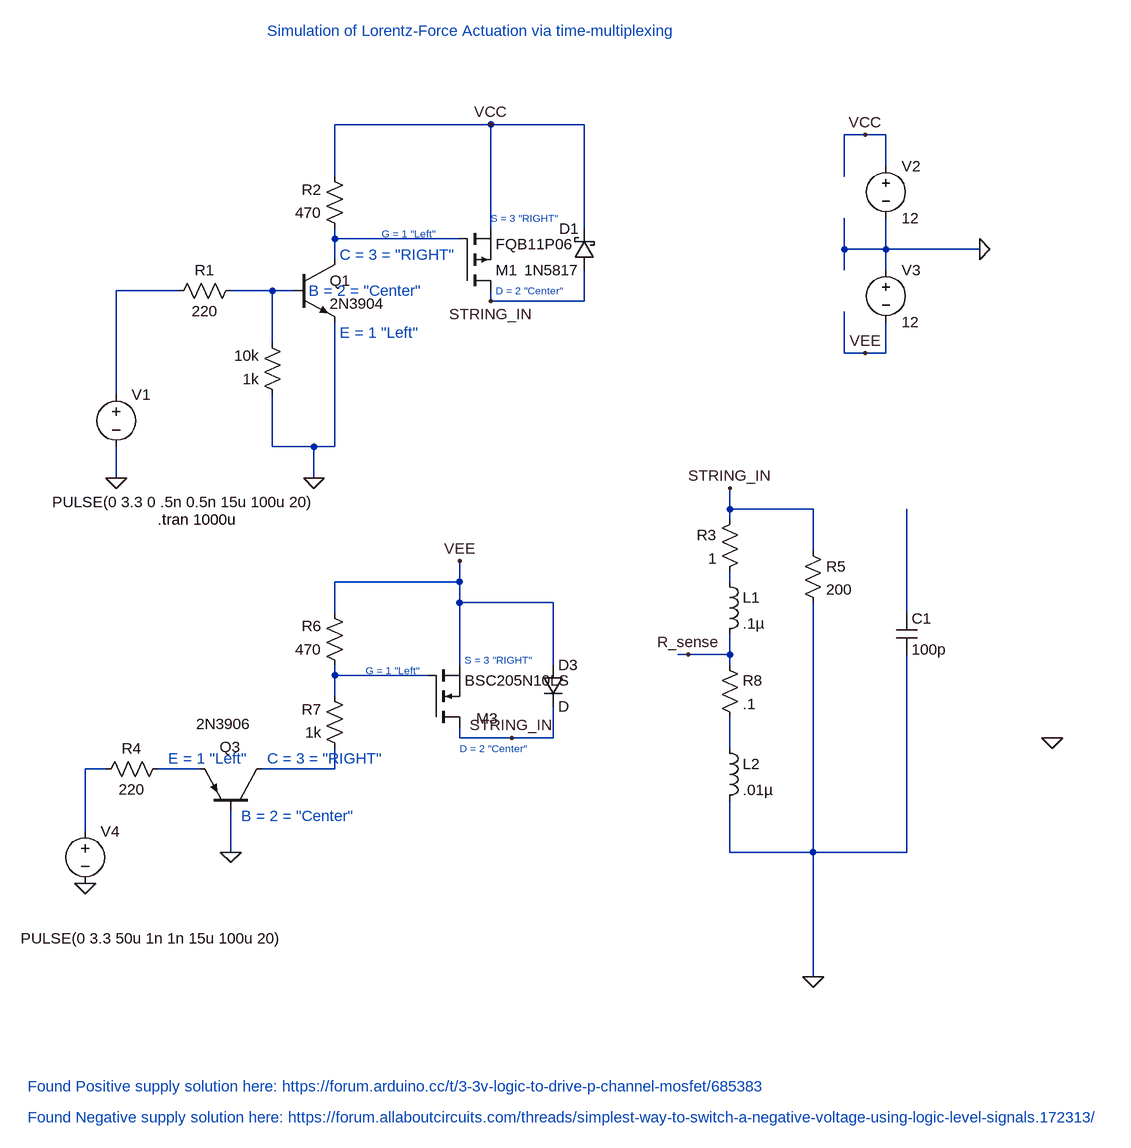
[diagram p0: schematic LF-TIME-MULTIPLEX-ACTUATION.asc]
LF-TIME-MULTIPLEX-ACTUATION.asc, the LTspice schematic file:
Version 4
SHEET 1 1528 1824
WIRE 544 -176 304 -176
WIRE 688 -176 544 -176
WIRE 1120 -160 1088 -160
WIRE 1152 -160 1120 -160
WIRE 1152 -112 1152 -160
WIRE 304 -96 304 -176
WIRE 1088 -96 1088 -160
WIRE 544 -16 544 -176
WIRE 688 -16 688 -176
WIRE 304 0 304 -16
WIRE 496 0 304 0
WIRE 1088 16 1088 -32
WIRE 1152 16 1152 -32
WIRE 1152 16 1088 16
WIRE 1296 16 1152 16
WIRE 304 32 304 0
WIRE 1088 48 1088 16
WIRE 1152 48 1152 16
WIRE 64 80 -32 80
WIRE 208 80 144 80
WIRE 240 80 208 80
WIRE 544 96 544 80
WIRE 688 96 688 48
WIRE 688 96 544 96
WIRE 208 160 208 80
WIRE 1088 176 1088 112
WIRE 1120 176 1088 176
WIRE 1152 176 1152 128
WIRE 1152 176 1120 176
WIRE -32 240 -32 80
WIRE 208 320 208 240
WIRE 272 320 208 320
WIRE 304 320 304 128
WIRE 304 320 272 320
WIRE -32 368 -32 320
WIRE 272 368 272 320
WIRE 912 416 912 384
WIRE 1040 416 912 416
WIRE 912 432 912 416
WIRE 1040 480 1040 416
WIRE 496 528 496 496
WIRE 496 528 304 528
WIRE 912 528 912 512
WIRE 496 560 496 528
WIRE 640 560 496 560
WIRE 304 576 304 528
WIRE 1184 576 1184 416
WIRE 848 640 832 640
WIRE 912 640 912 608
WIRE 912 640 848 640
WIRE 496 656 496 560
WIRE 640 656 640 560
WIRE 912 656 912 640
WIRE 304 672 304 656
WIRE 448 672 304 672
WIRE 304 704 304 672
WIRE 496 768 496 752
WIRE 576 768 496 768
WIRE 640 768 640 720
WIRE 640 768 576 768
WIRE 912 784 912 736
WIRE -48 816 -80 816
WIRE 96 816 32 816
WIRE 304 816 304 784
WIRE 304 816 192 816
WIRE -80 912 -80 816
WIRE 144 944 144 880
WIRE 912 944 912 864
WIRE 1040 944 1040 560
WIRE 1040 944 912 944
WIRE 1184 944 1184 640
WIRE 1184 944 1040 944
WIRE 1040 1136 1040 944
FLAG -32 368 0
FLAG 1120 176 VEE
FLAG 1296 16 0
FLAG 1120 -160 VCC
FLAG 272 368 0
FLAG 544 -176 VCC
FLAG 1040 1136 0
FLAG 912 384 STRING_IN
FLAG 544 96 STRING_IN
FLAG -80 992 0
FLAG 496 496 VEE
FLAG 576 768 STRING_IN
FLAG 144 944 0
FLAG 1408 768 0
FLAG 848 640 R_sense
SYMBOL voltage -32 224 R0
WINDOW 3 -99 181 Left 2
SYMATTR Value PULSE(0 3.3 0 .5n 0.5n 15u 100u 20)
SYMATTR InstName V1
SYMBOL voltage 1152 -128 R0
SYMATTR InstName V2
SYMATTR Value 12
SYMBOL pmos 496 80 M180
SYMATTR InstName M1
SYMATTR Value FQB11P06
SYMBOL npn 240 32 R0
SYMATTR InstName Q1
SYMATTR Value 2N3904
SYMBOL res 160 64 R90
WINDOW 0 0 56 VBottom 2
WINDOW 3 32 56 VTop 2
SYMATTR InstName R1
SYMATTR Value 220
SYMBOL res 320 0 R180
WINDOW 0 36 76 Left 2
WINDOW 3 36 40 Left 2
SYMATTR InstName R2
SYMATTR Value 470
SYMBOL res 928 416 M0
SYMATTR InstName R3
SYMATTR Value 1
SYMBOL voltage 1152 32 R0
SYMATTR InstName V3
SYMATTR Value 12
SYMBOL ind 896 512 R0
SYMATTR InstName L1
SYMATTR Value .1µ
SYMBOL res 224 256 R180
WINDOW 0 36 76 Left 2
WINDOW 3 36 40 Left 2
SYMATTR InstName 10k
SYMATTR Value 1k
SYMBOL schottky 704 48 R180
WINDOW 0 24 64 Left 2
WINDOW 3 24 0 Left 2
SYMATTR InstName D1
SYMATTR Value 1N5817
SYMATTR Description Diode
SYMATTR Type diode
SYMBOL res 1024 464 R0
SYMATTR InstName R5
SYMATTR Value 200
SYMBOL voltage -80 896 R0
WINDOW 3 -99 181 Left 2
SYMATTR Value PULSE(0 3.3 50u 1n 1n 15u 100u 20)
SYMATTR InstName V4
SYMBOL res 48 800 R90
WINDOW 0 0 56 VBottom 2
WINDOW 3 32 56 VTop 2
SYMATTR InstName R4
SYMATTR Value 220
SYMBOL res 320 672 R180
WINDOW 0 36 76 Left 2
WINDOW 3 36 40 Left 2
SYMATTR InstName R6
SYMATTR Value 470
SYMBOL res 320 800 R180
WINDOW 0 36 76 Left 2
WINDOW 3 36 40 Left 2
SYMATTR InstName R7
SYMATTR Value 1k
SYMBOL diode 624 656 R0
SYMATTR InstName D3
SYMBOL nmos 448 752 M180
WINDOW 0 74 14 Left 2
SYMATTR InstName M3
SYMATTR Value BSC205N10LS
SYMBOL pnp 192 880 M270
WINDOW 0 98 65 VLeft 2
WINDOW 3 133 101 VLeft 2
SYMATTR InstName Q3
SYMATTR Value 2N3906
SYMBOL res 896 640 R0
SYMATTR InstName R8
SYMATTR Value .1
SYMBOL cap 1168 576 R0
SYMATTR InstName C1
SYMATTR Value 100p
SYMBOL ind 896 768 R0
SYMATTR InstName L2
SYMATTR Value .01µ
TEXT 32 432 Left 2 !.tran 1000u
TEXT 48 800 Left 2 ;E = 1 "Left"
TEXT 160 888 Left 2 ;B = 2 = "Center"
TEXT 200 800 Left 2 ;C = 3 = "RIGHT"
TEXT 312 144 Left 2 ;E = 1 "Left"
TEXT 264 80 Left 2 ;B = 2 = "Center"
TEXT 312 24 Left 2 ;C = 3 = "RIGHT"
TEXT 352 664 Left 1 ;G = 1 "Left"
TEXT 496 784 Left 1 ;D = 2 "Center"
TEXT 504 648 Left 1 ;S = 3 "RIGHT"
TEXT 376 -8 Left 1 ;G = 1 "Left"
TEXT 544 -32 Left 1 ;S = 3 "RIGHT"
TEXT 552 80 Left 1 ;D = 2 "Center"
TEXT 200 -320 Left 2 ;Simulation of Lorentz-Force Actuation via time-multiplexing
TEXT -168 1352 Left 2 ;Found Negative supply solution here: https://forum.allaboutcircuits.com/threads/simplest-way-to-switch-a-negative-voltage-using-logic-level-signals.172313/
TEXT -168 1304 Left 2 ;Found Positive supply solution here: https://forum.arduino.cc/t/3-3v-logic-to-drive-p-channel-mosfet/685383

The netlist it stands for:
* LF-TIME-MULTIPLEX-ACTUATION.asc
V1 N002 0 PULSE(0 3.3 0 .5n 0.5n 15u 100u 20)
V2 VCC 0 12
M1 STRING_IN N001 VCC VCC FQB11P06
Q1 N001 N003 0 0 2N3904
R1 N003 N002 220
R2 N001 VCC 470
R3 STRING_IN N004 1
V3 0 VEE 12
L1 N004 R_sense .1µ
R§10k 0 N003 1k
D1 STRING_IN VCC 1N5817
R5 STRING_IN 0 200
V4 N008 0 PULSE(0 3.3 50u 1n 1n 15u 100u 20)
R4 N009 N008 220
R6 N006 VEE 470
R7 N010 N006 1k
D3 VEE STRING_IN D
M3 STRING_IN N006 VEE VEE BSC205N10LS
Q3 N010 0 N009 0 2N3906
R8 R_sense N007 .1
C1 N005 0 100p
L2 N007 0 .01µ
.model D D
.lib standard.dio
.model NPN NPN
.model PNP PNP
.lib standard.bjt
.model NMOS NMOS
.model PMOS PMOS
.lib standard.mos
.tran 1000u
* E = 1 "Left"
* B = 2 = "Center"
* C = 3 = "RIGHT"
* E = 1 "Left"
* B = 2 = "Center"
* C = 3 = "RIGHT"
* G = 1 "Left"
* D = 2 "Center"
* S = 3 "RIGHT"
* G = 1 "Left"
* S = 3 "RIGHT"
* D = 2 "Center"
* Simulation of Lorentz-Force Actuation via time-multiplexing
* Found Negative supply solution here: https://forum.allaboutcircuits.com/threads/simplest-way-to-switch-a-negative-voltage-using-logic-level-signals.172313/
* Found Positive supply solution here: https://forum.arduino.cc/t/3-3v-logic-to-drive-p-channel-mosfet/685383
.backanno
.end